# Altium schematic sheet Gps cape.SchDoc
size A4
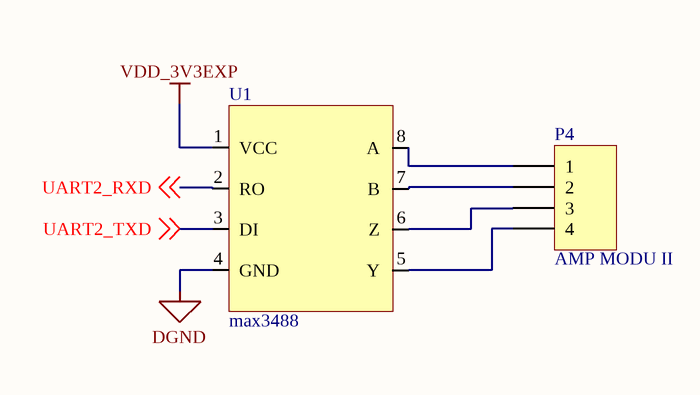
[diagram p0: Gps cape.SchDoc]

## Parts
P4  AMP MODU II  [MHDR1X4]
U1  max3488  [DIP-8]

## Nets
DGND: U1.4(GND)
VDD_3V3EXP: U1.1(VCC)
UART2_RXD: U1.2(RO) ; off-sheet UART2_RXD
UART2_TXD: U1.3(DI) ; off-sheet UART2_TXD
NetP4_1: P4.1 U1.8(A)
NetP4_2: P4.2 U1.7(B)
NetP4_3: P4.3 U1.6(Z)
NetP4_4: P4.4 U1.5(Y)

## Library data of the parts
P4 = MHDR1X4: Header, 4-Pin; LatestRevisionDate: 17-Jul-2002; LatestRevisionNote: Re-released for DXP Platform.; Publisher: Altium Limited
U1 = max3488: 3.3 V powered RS-485/RS-422 Transceiver